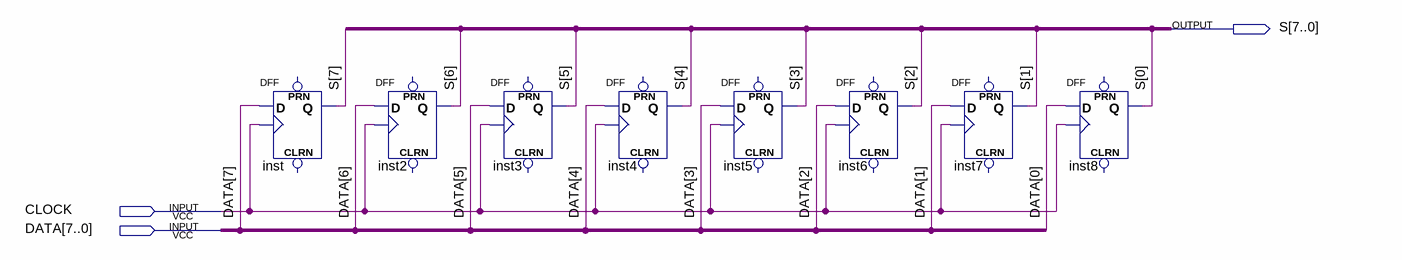
[diagram p0: schematic sheet]
// Quartus schematic register_8b.bdf as structural Verilog: 8 symbols, 3 pins
module register_8b (
  input  CLOCK,
  input  [7:0] DATA,
  output [7:0] S
);

  DFF inst (.CLK(CLOCK), .D(DATA[7]), .Q(S[7]));  // open: CLRN, PRN
  DFF inst2 (.CLK(CLOCK), .D(DATA[6]), .Q(S[6]));  // open: CLRN, PRN
  DFF inst3 (.CLK(CLOCK), .D(DATA[5]), .Q(S[5]));  // open: CLRN, PRN
  DFF inst4 (.CLK(CLOCK), .D(DATA[4]), .Q(S[4]));  // open: CLRN, PRN
  DFF inst5 (.CLK(CLOCK), .D(DATA[3]), .Q(S[3]));  // open: CLRN, PRN
  DFF inst6 (.CLK(CLOCK), .D(DATA[2]), .Q(S[2]));  // open: CLRN, PRN
  DFF inst7 (.CLK(CLOCK), .D(DATA[1]), .Q(S[1]));  // open: CLRN, PRN
  DFF inst8 (.CLK(CLOCK), .D(DATA[0]), .Q(S[0]));  // open: CLRN, PRN
endmodule
